# EAGLE design NMEA-v8-iso (EAGLE 6.4)
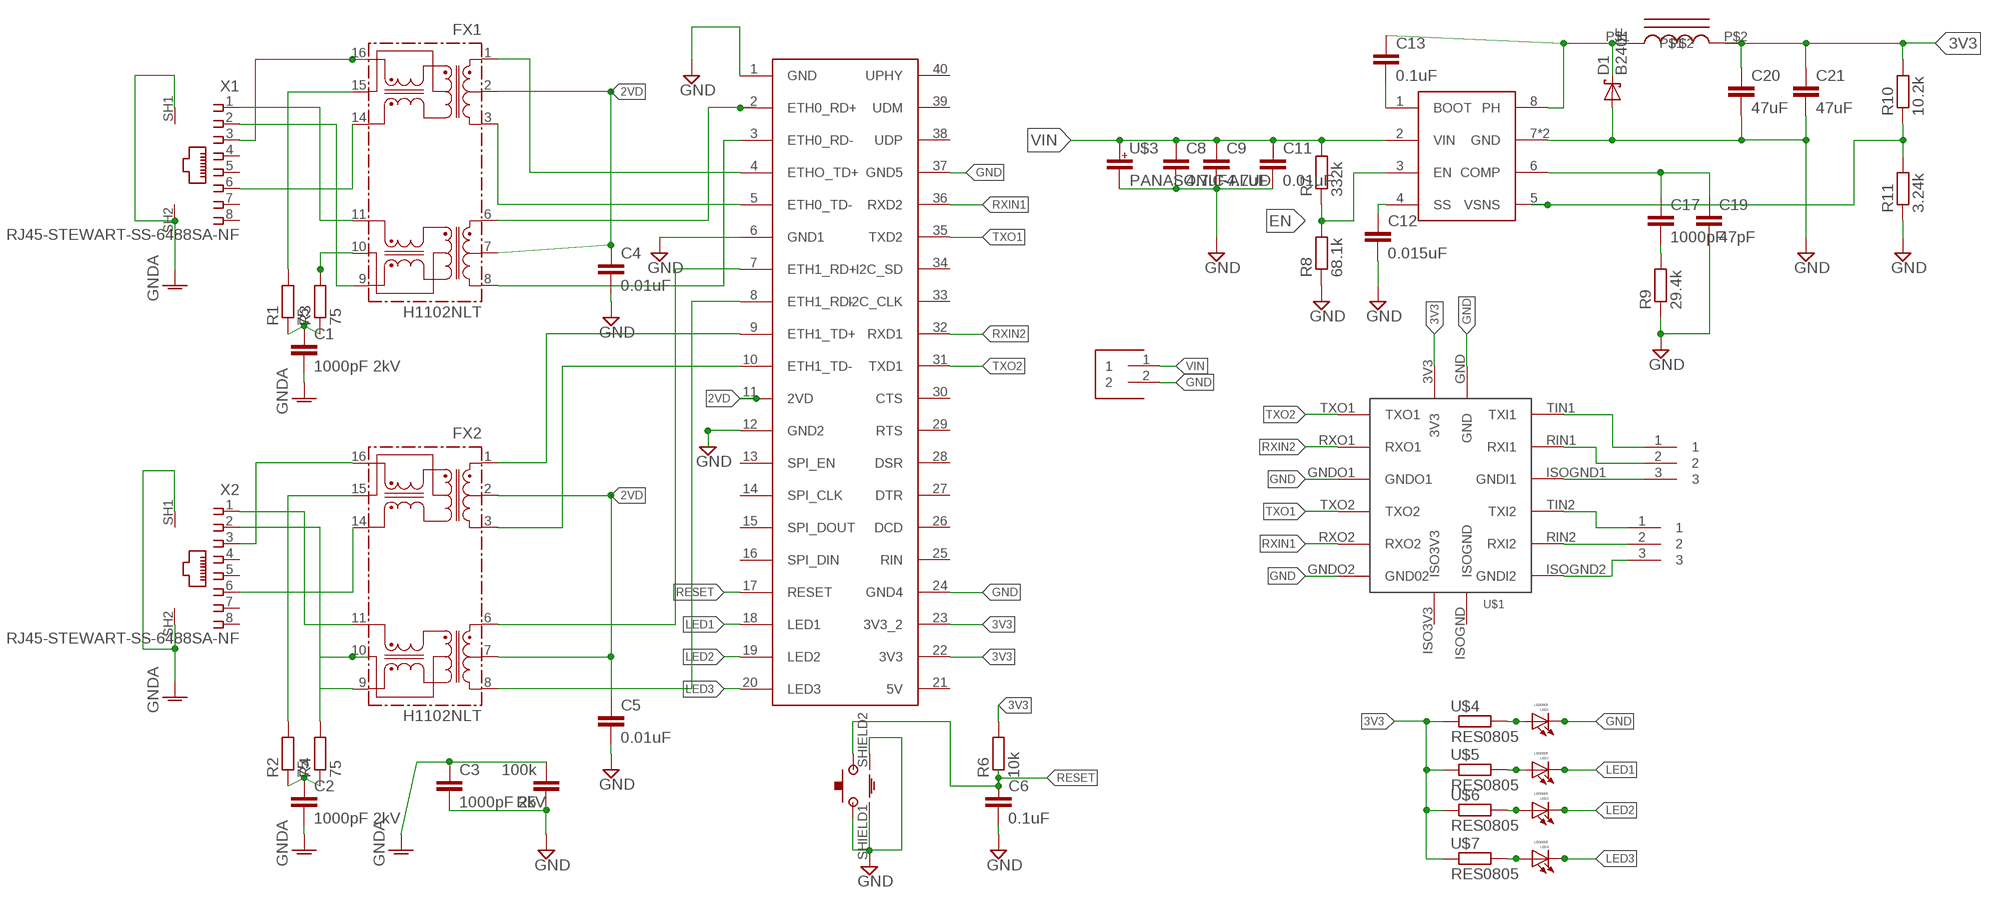
[diagram p0: schematic, sheet 1]

## Parts
C1  1000pF 2kV  CAP1206  [1206]
C2  1000pF 2kV  CAP1206  [1206]
C3  1000pF 2kV  CAP1206  [1206]
C4  0.01uF  CAP0805  [0805]
C5  0.01uF  CAP0805  [0805]
C6  0.1uF  CAP0805  [0805]
C8  4.7uF  CAP1210  [1210]
C9  4.7uF  CAP1210  [1210]
C11  0.01uF  CAP0805  [0805]
C12  0.015uF  CAP0805  [0805]
C13  0.1uF  CAP0805  [0805]
C17  1000pF  CAP0805  [0805]
C19  47pF  CAP0805  [0805]
C20  47uF  CAP1206  [1206]
C21  47uF  CAP1206  [1206]
CARAMBOLA  CARAMBOLA  [CARAMBOLA]
D1  B240F  [SMB]
DATA1  CON-3  [CON-3]
DATA2  CON-3  [CON-3]
FX1  H1102NLT  [H/HX1XXXNL]
FX2  H1102NLT  [H/HX1XXXNL]
J1  CON-5MM-2  [CON--5MM-2]
L1  CLF_TDK_INDUCTORCLF10040  [CLF10040]
LED1  LED0805  [L0805]
LED2  LED0805  [L0805]
LED3  LED0805  [L0805]
LED4  LED0805  [L0805]
R1  75  RES0805  [0805]
R2  75  RES0805  [0805]
R3  75  RES0805  [0805]
R4  75  RES0805  [0805]
R5  100k  CAP1206  [1206]
R6  10k  RES0805  [0805]
R7  332k  RES0805  [0805]
R8  68.1k  RES0805  [0805]
R9  29.4k  RES0805  [0805]
R10  10.2k  RES0805  [0805]
R11  3.24k  RES0805  [0805]
U8  TPS54231  [SOIC-THERMAL]
U$1  ISO-BOARD  [ISO-BOARD]
U$2  TACTILE-SWITCH-FSMRA1J  [TACTILE-SWITCH-FSMRA1J]
U$3  PANASONIC-ALUD  [PANASONIC_D]
U$4  RES0805  [0805]
U$5  RES0805  [0805]
U$6  RES0805  [0805]
U$7  RES0805  [0805]
X1  RJ45-STEWART-SS-6488SA-NF  [RJ45-STEWART-6488]
X2  RJ45-STEWART-SS-6488SA-NF  [RJ45-STEWART-6488]

## Nets
2VD: C4.1 C5.1 CARAMBOLA.11(2VD) FX1.2 FX1.7 FX2.2 FX2.7
3V3: C20.1 C21.1 CARAMBOLA.22(3V3) CARAMBOLA.23(3V3_2) L1.P$2 R6.2 R10.2 U$1.3V3 U$4.1 U$5.1 U$6.1 U$7.1
EN: R7.1 R8.2 U8.3(EN)
ETH1_RD: CARAMBOLA.8(ETH1_RD-) FX2.8
GND: C3.2 C4.2 C5.2 C6.2 C8.2 C9.2 C11.2 C12.2 C19.2 C20.2 C21.2 CARAMBOLA.1(GND) CARAMBOLA.6(GND1) CARAMBOLA.12(GND2) CARAMBOLA.24(GND4) CARAMBOLA.37(GND5) D1.A J1.2 LED1.C R5.1 R8.1 R9.1 R11.1 U8.7(GND) U8.P$1(GND) U$1.GND U$1.GNDO1 U$1.GNDO2(GND02) U$2.2 U$2.SHIELD1 U$2.SHIELD2 U$3.-
GNDA: C1.2 C2.2 C3.1 R5.2 X1.SH1 X1.SH2 X2.SH1 X2.SH2
ISOGND1: DATA1.3 U$1.ISOGND1(GNDI1)
ISOGND2: DATA2.3 U$1.ISOGND2(GNDI2)
LED1: CARAMBOLA.18(LED1) LED2.C
LED2: CARAMBOLA.19(LED2) LED3.C
LED3: CARAMBOLA.20(LED3) LED4.C
N$1: CARAMBOLA.4(ETHO_TD+) FX1.1
N$2: C13.2 U8.1(BOOT)
N$3: LED1.A U$4.2
N$4: LED2.A U$5.2
N$5: LED3.A U$6.2
N$6: R10.1 R11.2 U8.5(VSNS)
N$7: C17.1 C19.1 U8.6(COMP)
N$8: C17.2 R9.2
N$9: LED4.A U$7.2
N$11: CARAMBOLA.2(ETH0_RD+) FX1.6
N$13: CARAMBOLA.5(ETH0_TD-) FX1.3
N$16: CARAMBOLA.3(ETH0_RD-) FX1.8
N$17: C2.1 R2.1 R4.1
N$20: FX1.10 R3.2
N$21: FX1.15 R1.2
N$22: C1.1 R1.1 R3.1
N$23: FX1.11 X1.1
N$24: FX1.9 X1.2
N$25: FX1.16 X1.3
N$26: FX1.14 X1.6
N$27: CARAMBOLA.7(ETH1_RD+) FX2.6
N$28: CARAMBOLA.9(ETH1_TD+) FX2.1
N$30: CARAMBOLA.10(ETH1_TD-) FX2.3
N$31: FX2.15 R2.2
N$32: FX2.10 R4.2
N$33: FX2.16 X2.3
N$34: FX2.11 X2.1
N$35: FX2.14 X2.6
N$36: FX2.9 X2.2
PH: C13.1 D1.C L1.P$1 U8.8(PH)
RESET: C6.1 CARAMBOLA.17(RESET) R6.1 U$2.1
RIN1: DATA1.2 U$1.RIN1(RXI1)
RIN2: DATA2.2 U$1.RIN2(RXI2)
RXIN1: CARAMBOLA.36(RXD2) U$1.RXO2
RXIN2: CARAMBOLA.32(RXD1) U$1.RXO1
SS: C12.1 U8.4(SS)
TIN1: DATA1.1 U$1.TIN1(TXI1)
TIN2: DATA2.1 U$1.TIN2(TXI2)
TXO1: CARAMBOLA.35(TXD2) U$1.TXO2
TXO2: CARAMBOLA.31(TXD1) U$1.TXO1
VIN: C8.1 C9.1 C11.1 J1.1 R7.2 U8.2(VIN) U$3.+
Unconnected: CARAMBOLA.13(SPI_EN) CARAMBOLA.14(SPI_CLK) CARAMBOLA.15(SPI_DOUT) CARAMBOLA.16(SPI_DIN) CARAMBOLA.21(5V) CARAMBOLA.25(RIN) CARAMBOLA.26(DCD) CARAMBOLA.27(DTR) CARAMBOLA.28(DSR) CARAMBOLA.29(RTS) CARAMBOLA.30(CTS) CARAMBOLA.33(I2C_CLK) CARAMBOLA.34(I2C_SD) CARAMBOLA.38(UDP) CARAMBOLA.39(UDM) CARAMBOLA.40(UPHY) U$1.ISO3V3 U$1.ISOGND X1.4 X1.5 X1.7 X1.8 X2.4 X2.5 X2.7 X2.8

## Library data of the parts
C1-C6 C8 C9 C11-C13 C17 C19-C21 R5 = __bo_caps:CAP
CARAMBOLA = __my:CARAMBOLA
D1 = __my:B240
DATA1 DATA2 = __my:CON-3
FX1 FX2 = __my:H1102NLT
J1 = __my:CON-5MM-2
L1 = __my:CLF_TDK_INDUCTOR
LED1-LED4 = __my:LED: High Luminous Efficacy 3W Warm White LED Emitter Source: http://www.ledengin.com/products/3wLZ/LZ1-00WW03.pdf
R1-R4 R6-R11 U$4-U$7 = __bo_caps:RES
U8 = __my:TPS54231
U$1 = __my:ISO-BOARD
U$2 = __my:TACTILE-SWITCH-FSMRA
U$3 = __bo_caps:PANASONIC-ALU
X1 X2 = __my:RJ45-STEWART-SS-6488S

## Board
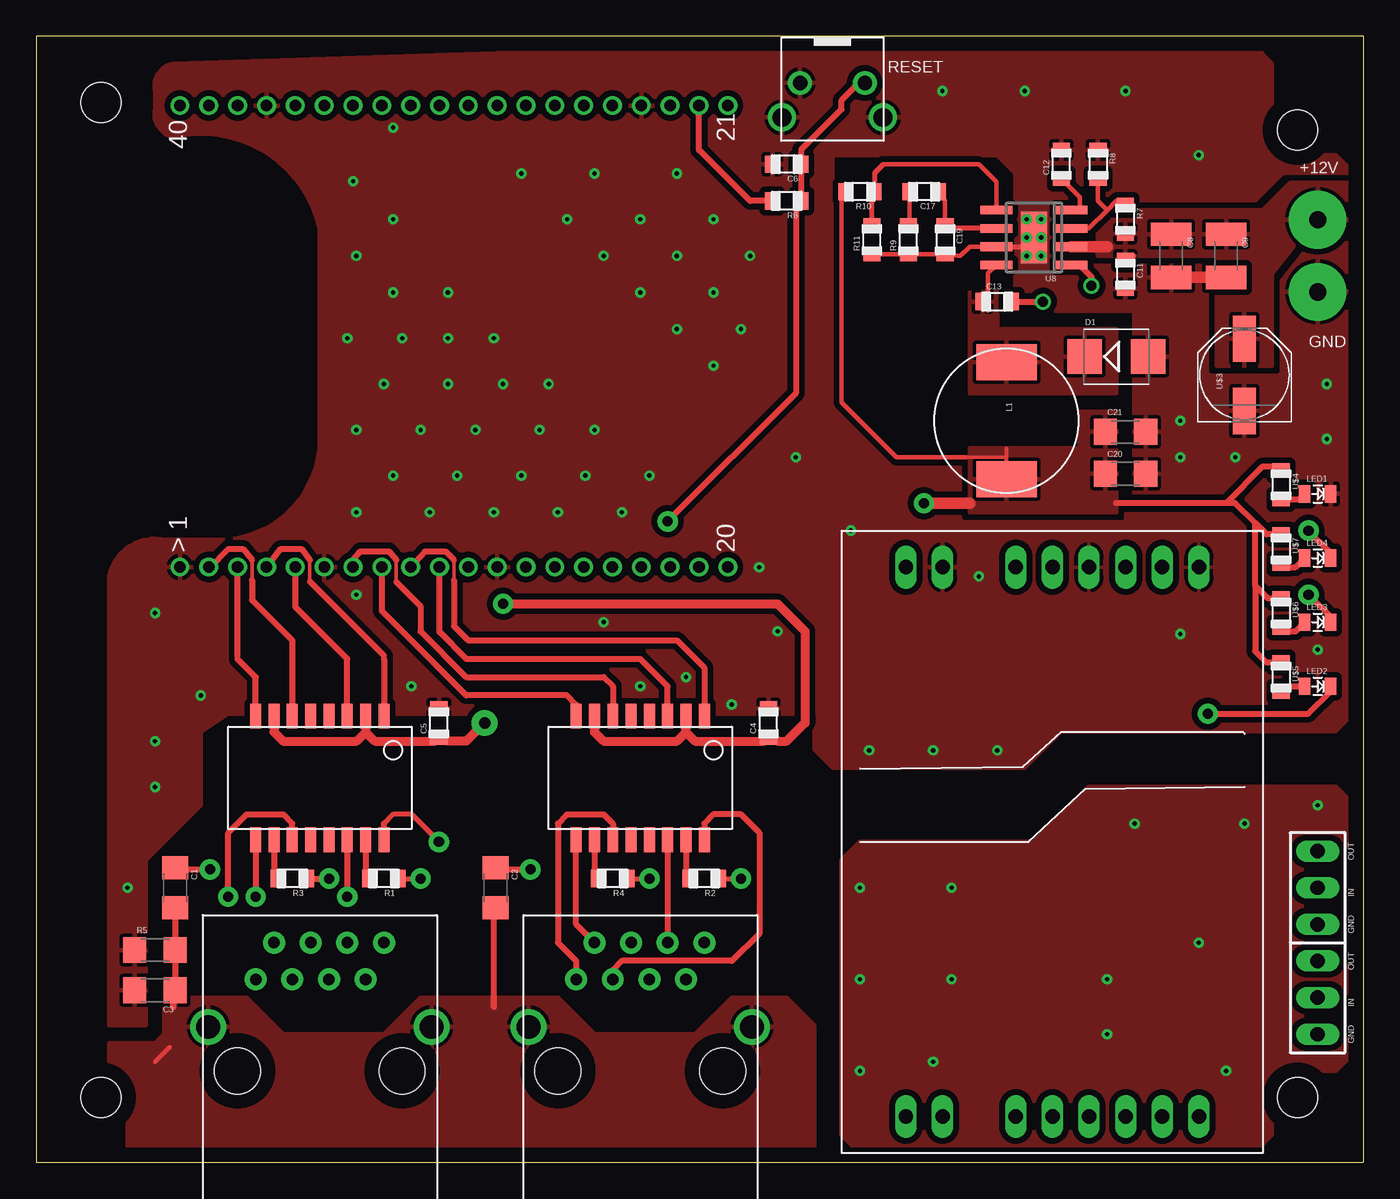
[diagram p1: board, top side]
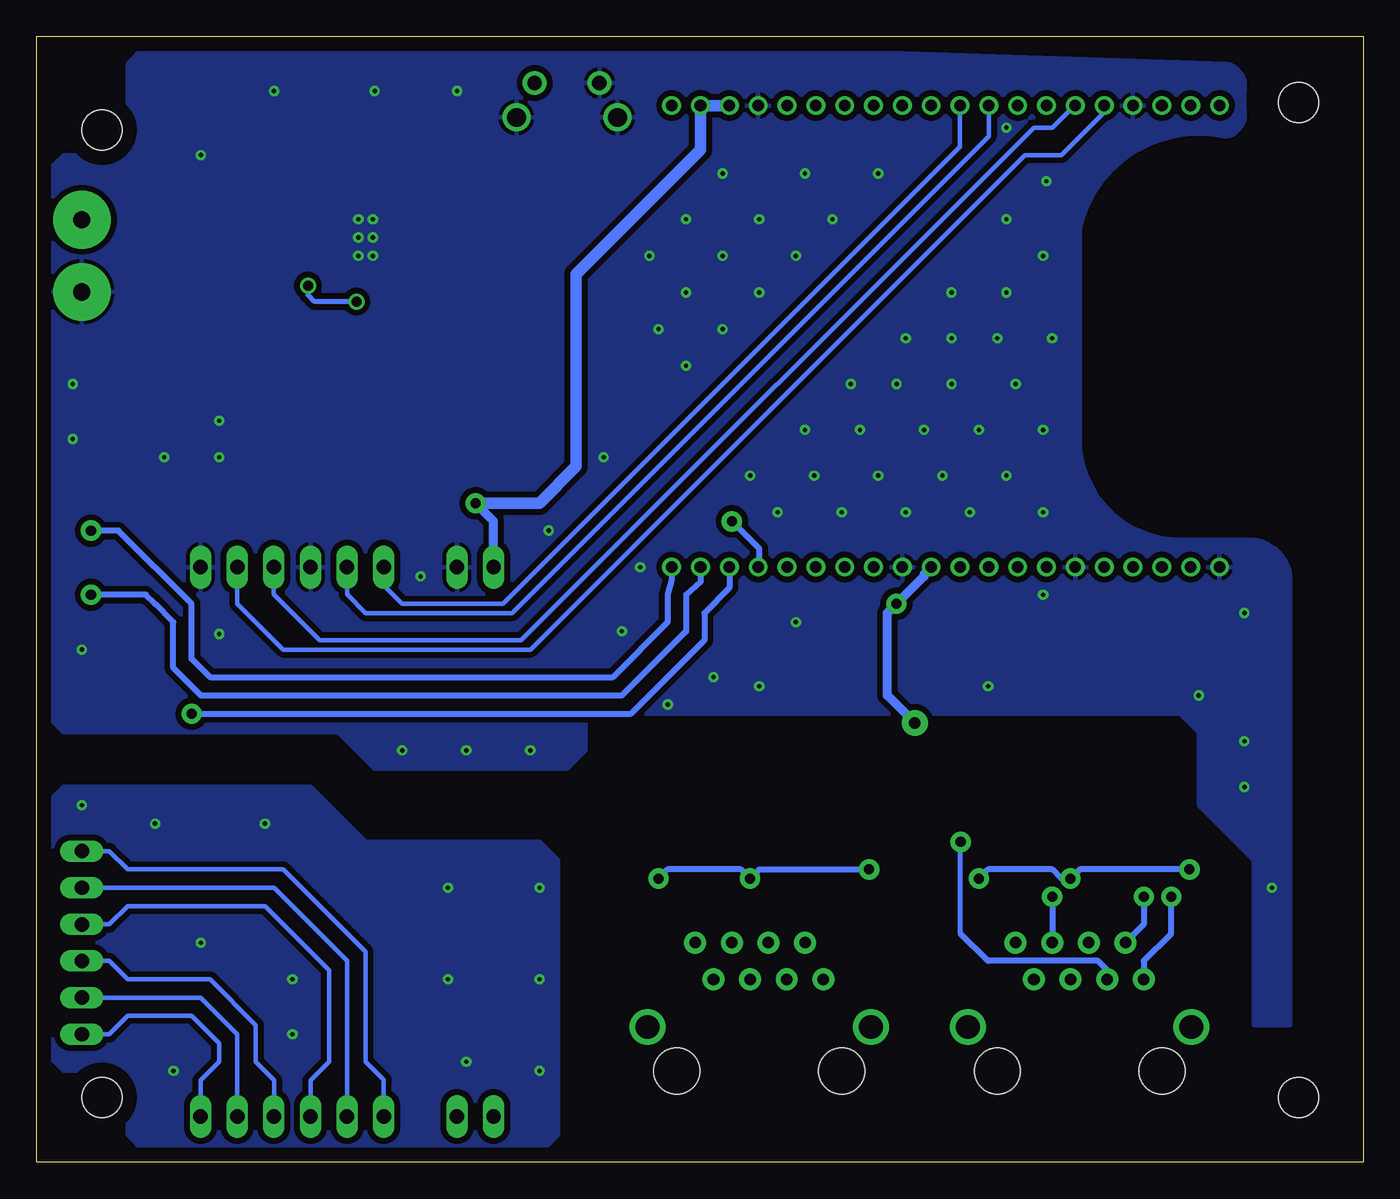
[diagram p2: board, bottom side, seen from below]

Size 92.08 x 78.11 mm. Coordinates in mm from the lower left corner, seen from the top.
Outline: 0,0 92.08,0 92.08,78.11 0,78.11 0,0
Copper layers (1*16): Top 0.035mm / dielectric 1.5mm / Bottom 0.035mm
Design rules "default *": minimum track width 8mil, minimum drill 10mil, track to track 8mil, track to pad 8mil, pad to pad 8mil, via to via 8mil, smd to smd 8mil, copper to edge 40mil, drill to drill 8mil, minimum pad ring 10mil, minimum via ring 8mil, stop-mask expansion 4mil, vias tented up to drill 0.35mm, thermal gap 10mil
Holes 2.8 mm at 4.5,73.5 87.5,71.59 87.5,4.5 4.5,4.5

### Footprints (pad centres in the part's own frame; a part is rotated, then mirrored left to right if it is on the bottom)
1206 = smd 1.6 x 1.8: 1 -1.4,0.127; 2 1.4,0.127
0805 = smd 1 x 1.2: 1 -1,0; 2 1,0
1210 = smd 1.6 x 2.8: 1 -1.5,0; 2 1.5,0
CARAMBOLA = drill 0.8: 1 -16,19; 2 -16,17; 3 -16,15; 4 -16,13; 5 -16,11; 6 -16,9; 7 -16,7; 8 -16,5; 9 -16,3; 10 -16,1; 11 -16,-1; 12 -16,-3; 13 -16,-5; 14 -16,-7; 15 -16,-9; 16 -16,-11; 17 -16,-13; 18 -16,-15; 19 -16,-17; 20 -16,-19; 21 16,-19; 22 16,-17; 23 16,-15; 24 16,-13; 25 16,-11; 26 16,-9; 27 16,-7; 28 16,-5; 29 16,-3; 30 16,-1; 31 16,1; 32 16,3; 33 16,5; 34 16,7; 35 16,9; 36 16,11; 37 16,13; 38 16,15; 39 16,17; 40 16,19
SMB = smd 2.4 x 2.4: A 2.2,0; C -2.2,0
CON-3 = drill 1 long: 1 0,2.54; 2 0,0; 3 0,-2.54
H/HX1XXXNL = smd 0.762 x 1.714: 1 -5.08,-4.286; 2 -3.81,-4.286; 3 -2.54,-4.286; 4 -1.27,-4.286; 5 0,-4.286; 6 1.27,-4.286; 7 2.54,-4.286; 8 3.81,-4.286; 9 3.81,4.286; 10 2.54,4.286; 11 1.27,4.286; 12 0,4.286; 13 -1.27,4.286; 14 -2.54,4.286; 15 -3.81,4.286; 16 -5.08,4.286
CON--5MM-2 = drill 1.2 pad 4: 1 0,2.5; 2 0,-2.5
CLF10040 = smd 2.5 x 4.2: P$1 -4.05,0; P$2 4.05,0
L0805 = smd 0.8 x 1.2: A -0.9,0; C 0.9,0
SOIC-THERMAL = smd 0.6 x 2.2: 1 -1.905,-2.6; 2 -0.635,-2.6; 3 0.635,-2.6; 4 1.905,-2.6; 5 1.905,2.6; 6 0.635,2.6; 7 -0.635,2.6; 8 -1.905,2.6 | smd 3.556 x 1.778: P$1 0,0
ISO-BOARD = drill 1 long: 3V3 -10.16,19.05; GND -7.62,19.05; GNDO1 2.54,19.05; GNDO2 10.16,19.05; ISO3V3 -10.16,-19.05; ISOGND -7.62,-19.05; ISOGND1 2.54,-19.05; ISOGND2 10.16,-19.05; RIN1 0,-19.05; RIN2 7.62,-19.05; RXO1 0,19.05; RXO2 7.62,19.05; TIN1 -2.54,-19.05; TIN2 5.08,-19.05; TXO1 -2.54,19.05; TXO2 5.08,19.05
TACTILE-SWITCH-FSMRA1J = drill 0.99 pad 1.651: 1 -2.248,-1.194; 2 2.248,-1.194 | drill 1.3: SHIELD1 -3.505,1.194; SHIELD2 3.505,1.194
PANASONIC_D = smd 3.2 x 1.6: + 2.5,0; - -2.5,0
RJ45-STEWART-6488 = drill 0.8 pad 1.524: 1 -4.445,6.35; 2 -3.175,8.89; 3 -1.905,6.35; 4 -0.635,8.89; 5 0.635,6.35; 6 1.905,8.89; 7 3.175,6.35; 8 4.445,8.89 | drill 1.651: SH1 -7.747,3.048; SH2 7.747,3.048 | hole 3.175: -5.715,0; 5.715,0

### Placement (x,y rotation side)
C1  9.53,19.05 270 top
C2  31.75,19.05 270 top
C3  8.26,12.06 180 top
C4  50.8,30.48 90 top
C5  27.94,30.48 90 top
C6  52.07,69.22 180 top
C8  78.74,62.87 270 top
C9  82.55,62.87 270 top
C11  75.56,61.59 270 top
C12  71.12,69.22 90 top
C13  66.67,59.69 0 top
C17  61.59,67.31 180 top
C19  63.05,63.98 270 top
C20  75.56,47.62 0 top
C21  75.56,50.53 0 top
CARAMBOLA  28.98,57.28 90 top
D1  74.93,55.88 0 top
DATA1  88.9,19.05 0 top
DATA2  88.9,11.43 0 top
FX1  19.05,26.67 180 top
FX2  41.27,26.67 180 top
J1  88.9,62.87 0 top
L1  67.31,51.44 270 top
LED1  88.9,46.35 0 top
LED2  88.9,33.02 0 top
LED3  88.9,37.47 0 top
LED4  88.9,41.91 0 top
R1  24.13,19.68 180 top
R2  46.35,19.68 180 top
R3  17.78,19.68 180 top
R4  40.01,19.68 180 top
R5  8.26,14.61 0 top
R6  52.07,66.67 180 top
R7  75.56,65.41 270 top
R8  73.66,69.22 270 top
R9  60.52,63.98 90 top
R10  57.15,67.31 180 top
R11  57.98,63.98 90 top
U8  69.22,64.14 90 top
U$1  70.5,22.23 0 top
U$2  55.24,73.66 180 top
U$3  83.82,54.61 90 top
U$4  86.36,46.99 270 top
U$5  86.36,33.66 270 top
U$6  86.36,38.1 270 top
U$7  86.36,42.55 270 top
X1  19.68,6.35 0 top
X2  41.91,6.35 0 top

### Tracks (layer width: path | path; a pad name or v marks a point on that pad's centre or on a via)
2VD  (via drill 0.7 pad 1.4, 0.8 pad 1.78)
  Top 0.305: 28.57,29.21 C5.1 | 51.44,29.21 C4.1 | 38.73,31.11 38.73,30.48 | FX2.2 45.09,30.48
  Top 0.356: FX2.2 45.09,31.11 | FX2.7 38.73,31.11 | 28.16,29.84 C5.1
  Top 0.61: v32.38,38.73 51.44,38.73 53.34,36.83 53.34,30.48 52.07,29.21 51.44,29.21 | 28.57,29.21 29.84,29.21 v31.11,30.48 | 45.09,29.84 FX2.2 | 38.73,31.11 38.73,29.84 39.37,29.21 44.45,29.21 45.09,29.84 | 45.09,29.84 45.72,29.21 50.53,29.21 C4.1 | FX1.7 16.51,29.84 17.14,29.21 22.23,29.21 22.86,29.84 | FX1.2 22.86,29.84 | 22.86,29.84 23.5,29.21 27.67,29.21 C5.1
  Bottom 0.61: v31.11,30.48 33.02,32.38 33.02,38.1 v32.38,38.73 30.48,40.64 30.48,40.79 CARAMBOLA.11
3V3  (via drill 0.7 pad 1.4)
  Top 0.254: 64.53,48.9 67.31,48.9 | 67.31,48.9 67.31,49.53 | 67.31,48.9 L1.P$2
  Top 0.305: 56.07,67.78 55.88,67.59 55.88,52.7 59.69,48.9 64.53,48.9
  Top 0.356: R10.2 56.07,67.78
  Top 0.406: 85.94,39.37 U$6.1 85.47,39.1 84.56,40.01 | U$4.1 86.09,48.26 85.09,48.26 82.55,45.72 | R6.2 49.53,66.67 45.98,70.22 CARAMBOLA.22 | 82.55,45.72 83.19,45.72 84.56,44.34 | 82.55,45.72 74.93,45.72 | U$7.1 85.36,43.55 84.56,44.34 | U$5.1 85.36,34.66 84.56,35.45 84.56,40.01 | 84.56,40.01 84.56,44.34
  Top 0.813: 64.77,45.72 v61.59,45.72
  Bottom 0.61: U$1.3V3 60.34,44.47 v61.59,45.72
  Bottom 0.813: CARAMBOLA.23 CARAMBOLA.22 45.98,70.22 54.61,61.59 54.61,48.26 57.15,45.72 v61.59,45.72
  pour Top (isolate 0.61): 74.93,45.09 64.77,45.09 64.77,49.53 72.39,49.53 72.39,52.07 74.93,52.07
EN
  Top 0.305: U8.3 73.03,64.77 74.3,66.04 | 74.3,66.04 73.66,66.67 R8.2 | 74.3,66.04 74.93,66.67 75.3,66.67 R7.1
ETH1_RD
  Top 0.305: 37.47,31.75 FX2.8
  Top 0.406: 37.47,31.75 36.83,32.38 29.84,32.38 23.98,38.24 CARAMBOLA.8
GND  (via drill 0.3)
  Top 0.305: U8.7 64.77,63.5 64.14,62.87 63.95,62.87 C19.2 R9.1 R11.1
  Top 0.356: U8.7 69.22,63.5 U8.P$1
  Top 0.813: C8.2 C9.2
  other vias: 89.53,50.16 52.7,48.9 8.26,29.21 24.13,53.98 51.44,36.83 8.26,26.04 50.16,41.27 79.38,36.64 56.52,43.81 57.78,28.57 26.04,33.02 22.23,39.37 62.87,74.3 68.58,74.3 75.56,74.3 79.38,51.44 89.53,53.98 83.19,48.9 28.57,53.98 32.38,53.98 35.56,53.98 26.67,50.8 30.48,50.8 34.92,50.8 38.73,50.8 25.4,57.15 28.57,57.15 28.57,60.33 24.77,60.33 24.77,65.41 22.23,62.87 21.59,57.15 22.23,50.8 24.77,47.62 29.21,47.62 33.66,47.62 38.1,47.62 36.83,65.41 41.91,65.41 46.99,65.41 39.37,62.87 44.45,62.87 49.53,62.87 33.66,68.58 38.73,68.58 44.45,68.58 68.71,65.41 69.72,65.41 68.71,64.14 68.71,62.87 69.72,64.14 69.72,62.87 31.75,57.15 41.91,60.33 46.99,60.33 44.45,57.78 48.9,57.78 46.99,55.24 22.23,45.09 27.3,45.09 31.75,45.09 36.2,45.09 40.64,45.09 42.55,47.62 6.35,19.05 8.26,38.1 11.43,32.38 79.38,48.9 65.41,40.64 66.67,28.57 21.99,68.04 24.77,71.75 62.23,28.57 88.9,35.56 39.37,37.47 48.26,31.75 45.09,33.66 41.91,33.02 80.64,69.85
  pour Top (isolate 0.406): 70.04,67.78 70.04,69.85 74.93,69.85 76.83,71.75 76.83,77.47 55.24,77.47 55.24,69.85 66.67,69.85 67.94,68.58 67.94,67.78
  pour Top (isolate 0.406, rank 2): 67.94,77.47 84.45,77.47 85.72,76.2 85.72,71.12 87,69.85 90.17,69.85 91.44,68.58 91.44,44.22 76.2,44.22 76.2,59.05 67.94,59.05
  pour Top (isolate 0.61): 5.71,40.01 5.71,31.75 51.44,31.75 51.44,40.01
  pour Bottom (isolate 0.406): 5.08,31.11 5.08,40.01 arc-90 7.62,43.18 12.7,43.18 arc90 19.68,50.16 19.68,64.77 arc90 9.53,71.12 arc-90 8.26,73.03 8.26,74.3 arc-90 9.53,76.2 48.9,77.47 84.45,77.47 85.72,76.2 85.72,71.12 87,69.85 90.17,69.85 91.44,68.58 91.44,31.11 90.17,29.84 71.12,29.84 68.58,27.3 55.24,27.3 53.98,28.57 53.98,30.48 53.34,31.11
  pour Bottom (isolate 0.61): 5.08,33.02 5.08,9.53 7.62,9.53 7.62,20.95 11.43,24.77 11.43,29.84 13.34,31.75 13.34,33.02
  pour Top (isolate 0.406, rank 2): 9.53,76.2 48.9,77.47 55.24,77.47 55.24,52.7 59.69,48.26 64.77,48.26 64.77,31.11 13.34,31.11 11.43,29.84 11.43,24.77 7.62,20.95 7.62,9.53 5.08,9.53 5.08,40.64 arc-90 8.89,43.18 12.7,43.18 arc90 19.68,50.16 19.68,64.77 arc90 9.53,71.12 arc-90 8.26,73.03 8.26,74.3 arc-90
  pour Top (isolate 0.406, rank 2): 91.44,45.53 91.44,31.11 90.17,29.84 71.12,29.84 68.58,27.3 55.24,27.3 53.98,28.57 53.98,45.53
  pour Top (isolate 0.406, no thermals): 67.94,67.94 67.94,60.96 70.48,60.96 70.48,67.94
GNDA
  Top 0.305: 9.26,7.99 8.26,6.99
  Top 0.406: 9.53,10.79 C3.1 R5.2 9.65,17.02 C1.2 | C2.2 31.75,17.52 31.75,10.79
  pour Top (isolate 0.305, rank 3): 8.89,11.43 14.61,11.43 17.14,8.89 24.13,8.89 26.67,11.43 36.2,11.43 38.73,8.89 45.72,8.89 48.26,11.43 52.07,11.43 53.98,9.53 53.98,0.64 6.35,0.64 6.35,5.71 5.08,6.99 5.08,8.26 8.26,8.26 8.89,8.89
ISOGND  (via drill 0.3)
  other vias: 57.15,19.05 63.5,19.05 88.9,24.77 63.5,12.7 57.15,12.7 57.15,6.35 62.23,6.99 74.3,8.89 74.3,12.7 80.64,15.24 83.82,23.5 76.2,23.5 82.55,6.35
  pour Top (isolate 0.406): 55.88,20.95 57.15,22.23 69.22,22.23 73.03,26.04 90.17,26.04 91.44,24.77 91.44,7.62 90.17,6.35 87,6.35 85.72,5.08 85.72,1.91 84.45,0.64 57.15,0.64 55.88,1.91
  pour Bottom (isolate 0.406): 55.88,1.91 57.15,0.64 84.45,0.64 85.72,1.91 85.72,5.08 87,6.35 90.17,6.35 91.44,7.62 91.44,24.77 90.17,26.04 73.03,26.04 69.22,22.23 57.15,22.23 55.88,20.95
ISOGND1
  Bottom 0.305: DATA1.3 87,16.51 85.72,17.78 76.2,17.78 71.75,13.34 71.75,6.99 73.04,5.7 U$1.ISOGND1
ISOGND2
  Bottom 0.305: DATA2.3 87,8.89 85.72,10.16 81.28,10.16 79.38,8.26 79.38,6.99 80.66,5.7 U$1.ISOGND2
LED1  (via drill 0.7 pad 1.4)
  Top 0.305: 89.8,32.65 LED2.C
  Top 0.406: v81.28,31.11 88.27,31.11 89.8,32.65
  Bottom 0.406: v81.28,31.11 50.8,31.11 45.72,36.2 45.72,38.1 43.98,39.84 CARAMBOLA.18
LED2  (via drill 0.7 pad 1.4)
  Top 0.305: 89.8,37.2 LED3.C 89.8,37.84
  Top 0.406: v88.27,39.37 89.8,37.84
  Bottom 0.406: CARAMBOLA.19 45.98,40.27 46.99,39.37 46.99,36.83 51.44,32.38 80.64,32.38 82.55,34.29 82.55,37.47 83.82,38.73 84.45,39.37 v88.27,39.37
LED3  (via drill 0.7 pad 1.4)
  Top 0.305: 89.8,41.65 LED4.C
  Top 0.406: LED4.C 89.8,42.28 v88.27,43.81
  Bottom 0.406: CARAMBOLA.20 47.98,40.37 48.26,39.37 48.26,37.47 52.07,33.66 80.01,33.66 81.28,34.92 81.28,38.73 86.36,43.81 v88.27,43.81
N$1
  Top 0.254: 18.98,41.78 18.98,40.28
  Top 0.305: 24.13,34.92 24.13,35.14
  Top 0.406: 24.13,34.92 FX1.1 | CARAMBOLA.4 16.97,42.55 18.41,42.55 18.98,41.78 | 24.13,35.14 18.98,40.28
N$2  (via drill 0.7)
  Top 0.305: 72.39,62.23 U8.1
  Top 0.406: C13.2 v69.85,59.69 | v73.22,60.8 73.22,61.41 72.39,62.23
  Bottom 0.356: v73.22,60.8 73.22,60.16 72.74,59.69 v69.85,59.69
N$3
  Top 0.406: U$4.2 87.64,45.99 LED1.A
N$4
  Top 0.406: U$5.2 86.58,33.02 LED2.A
N$5
  Top 0.406: U$6.2 86.58,36.83 87.36,36.83 LED3.A
N$6
  Top 0.305: U8.5 66.61,68 65.41,69.22 58.77,69.22
  Top 0.356: R11.2 57.98,67.57 R10.1 58.19,68.64 58.77,69.22
N$7
  Top 0.305: C17.1 63.05,66.73 C19.1
  Top 0.356: U8.6 63.11,64.77 C19.1
N$8
  Top 0.305: C17.2 60.59,65.06 R9.2
N$9
  Top 0.406: U$7.2 86.36,41.27 87.36,41.27 LED4.A
N$11
  Top 0.254: 14.98,41.78 14.98,40.39
  Top 0.305: CARAMBOLA.2 12.05,41.28 12.06,41.27
  Top 0.406: 12.06,41.27 13.34,42.55 14.35,42.55 14.98,41.78 | 14.98,40.39 14.98,38.99 17.78,36.2 FX1.6
N$13
  Top 0.406: CARAMBOLA.5 17.98,38.53 21.59,34.92 FX1.3
N$16
  Top 0.305: 13.98,35.11 13.98,34.91
  Top 0.406: FX1.8 15.24,33.66 13.98,34.91 | 13.98,35.11 CARAMBOLA.3
N$17  (via drill 0.7 pad 1.4)
  Top 0.356: R4.1 v42.55,19.68 | R2.1 v48.9,19.68
  Top 0.406: C2.1 32.01,20.32 v34.29,20.32
  Bottom 0.406: v34.29,20.32 41.91,20.32 v42.55,19.68 43.18,20.32 48.26,20.32 v48.9,19.68
N$20
  Top 0.406: FX1.10 16.51,20.11 R3.2
N$21
  Top 0.356: 22.86,20.11 R1.2
  Top 0.406: FX1.15 22.86,20.11
N$22  (via drill 0.7 pad 1.4)
  Top 0.305: C1.1 10.16,20.32
  Top 0.356: R1.1 v26.67,19.68
  Top 0.406: 10.16,20.32 v12.06,20.32 | 18.41,19.68 R3.1 v20.32,19.68
  Bottom 0.406: v26.67,19.68 26.04,20.32 21.59,20.32 20.95,19.68 v20.32,19.68 19.68,20.32 v12.06,20.32
N$23  (via drill 0.7 pad 1.4)
  Top 0.406: FX1.11 17.78,23.5 17.14,24.13 14.61,24.13 13.34,22.86 v13.34,18.41
  Bottom 0.406: v13.34,18.41 13.34,15.88 15.24,13.97 X1.1
N$24  (via drill 0.7 pad 1.4)
  Top 0.406: FX1.9 15.23,18.65 v15.24,18.41
  Bottom 0.406: v15.24,18.41 15.24,16.51 X1.2
N$25  (via drill 0.7 pad 1.4)
  Top 0.356: 24.13,23.5 24.77,24.13 26.04,24.13 v27.94,22.23
  Top 0.406: FX1.16 24.13,23.5
  Bottom 0.356: 27.94,15.88 v27.94,22.23
  Bottom 0.406: X1.3 17.78,13.34 18.41,13.97 26.04,13.97 27.94,15.88
N$26  (via drill 0.7 pad 1.4)
  Top 0.406: FX1.14 21.58,18.37 v21.59,18.41
  Bottom 0.406: v21.59,18.41 X1.6
N$27
  Top 0.254: 24.98,41.78 24.98,40.26
  Top 0.406: FX2.6 40.01,33.02 39.37,33.66 29.84,33.66 26.67,36.83 26.67,38.57 24.98,40.26 | CARAMBOLA.7 21.98,41.78 22.48,42.37 24.48,42.37 24.98,41.78
N$28
  Top 0.254: 28.98,41.78 28.98,40.37
  Top 0.406: CARAMBOLA.9 26.98,42.37 28.4,42.37 28.98,41.78 | FX2.1 46.35,34.29 44.45,36.2 29.98,36.2 28.98,37.19 28.98,40.37
N$30
  Top 0.406: FX2.3 43.81,33.02 41.91,34.92 29.84,34.92 27.98,36.78 CARAMBOLA.10
N$31
  Top 0.305: 45.09,20.11 R2.2
  Top 0.406: FX2.15 45.09,20.11
N$32
  Top 0.305: 38.73,20.11 R4.2
  Top 0.406: FX2.10 38.73,20.11
N$33
  Top 0.406: FX2.16 46.35,23.5 46.99,24.13 48.9,24.13 50.16,22.86 50.16,15.88 48.26,13.97 40.64,13.97 40.01,13.34 X2.3
N$34
  Top 0.406: FX2.11 40.01,23.5 39.37,24.13 36.83,24.13 36.2,23.5 36.2,15.24 37.47,13.97 X2.1
N$35
  Top 0.406: FX2.14 43.81,17.78 X2.6
N$36
  Top 0.406: FX2.9 37.47,16.51 X2.2
PH
  Top 0.305: 67.59,56.52 L1.P$1 | U8.8 66.04,61.66 66.04,59.05 C13.1
  pour Top (isolate 0.406): 66.67,60.33 66.67,57.78 74.93,57.78 74.93,53.34 64.77,53.34 64.77,60.33
RESET  (via drill 0.7 pad 1.4)
  Top 0.406: v43.81,44.45 52.7,53.34 52.7,66.41 R6.1 C6.1 53.07,70.22 55.88,73.03 55.88,73.66 57.07,74.85 U$2.1
  Bottom 0.406: CARAMBOLA.17 41.91,41.36 41.91,42.55 v43.81,44.45
RIN1
  Bottom 0.305: DATA1.2 75.56,19.05 70.5,13.98 U$1.RIN1
RIN2
  Bottom 0.305: U$1.RIN2 78.12,8.9 80.64,11.43 DATA2.2
RXIN1
  Bottom 0.305: U$1.RXO2 78.12,38.75 74.93,35.56 57.78,35.56 23.5,69.85 20.95,69.85 17.98,72.82 CARAMBOLA.36
RXIN2
  Bottom 0.305: U$1.RXO1 70.5,39.38 69.22,38.1 59.05,38.1 25.98,71.17 CARAMBOLA.32
SS
  Top 0.305: C12.1 72.39,66.92 72.39,66.04 U8.4
TIN1
  Bottom 0.305: DATA1.1 87,21.59 85.72,20.32 74.93,20.32 69.22,14.61 69.22,6.99 67.96,5.73 U$1.TIN1
TIN2
  Bottom 0.305: DATA2.1 87,13.97 85.72,12.7 80.01,12.7 76.83,9.53 76.83,6.99 75.56,5.71 75.56,3.19 U$1.TIN2
TXO1
  Bottom 0.305: 20.06,73.28 21.59,71.75 22.86,71.75 58.42,36.2 72.39,36.2 75.58,39.38 U$1.TXO2
  Bottom 0.406: CARAMBOLA.35 20.06,73.28
TXO2
  Bottom 0.305: U$1.TXO1 67.96,40.02 66.67,38.73 59.69,38.73 27.98,70.44 CARAMBOLA.31
VIN
  Top 0.305: 76.2,62.87 C11.1
  Top 0.813: U8.2 74.3,63.5
  pour Top (isolate 0.406): 73.66,62.87 73.66,66.04 85.09,66.04 87,67.94 91.44,67.94 91.44,64.77 88.27,64.77 85.72,61.59 85.72,55.24 81.92,55.24 81.92,62.87

### Text on the board
tPlace: RESET | +12V | GND | OUT | IN | GND | OUT | IN | GND
DrillLegend_01-16: 01-16
DrillLegend_01-20: 01-20